# EAGLE design flexNT2_V1.0 (EAGLE 9.6.2)
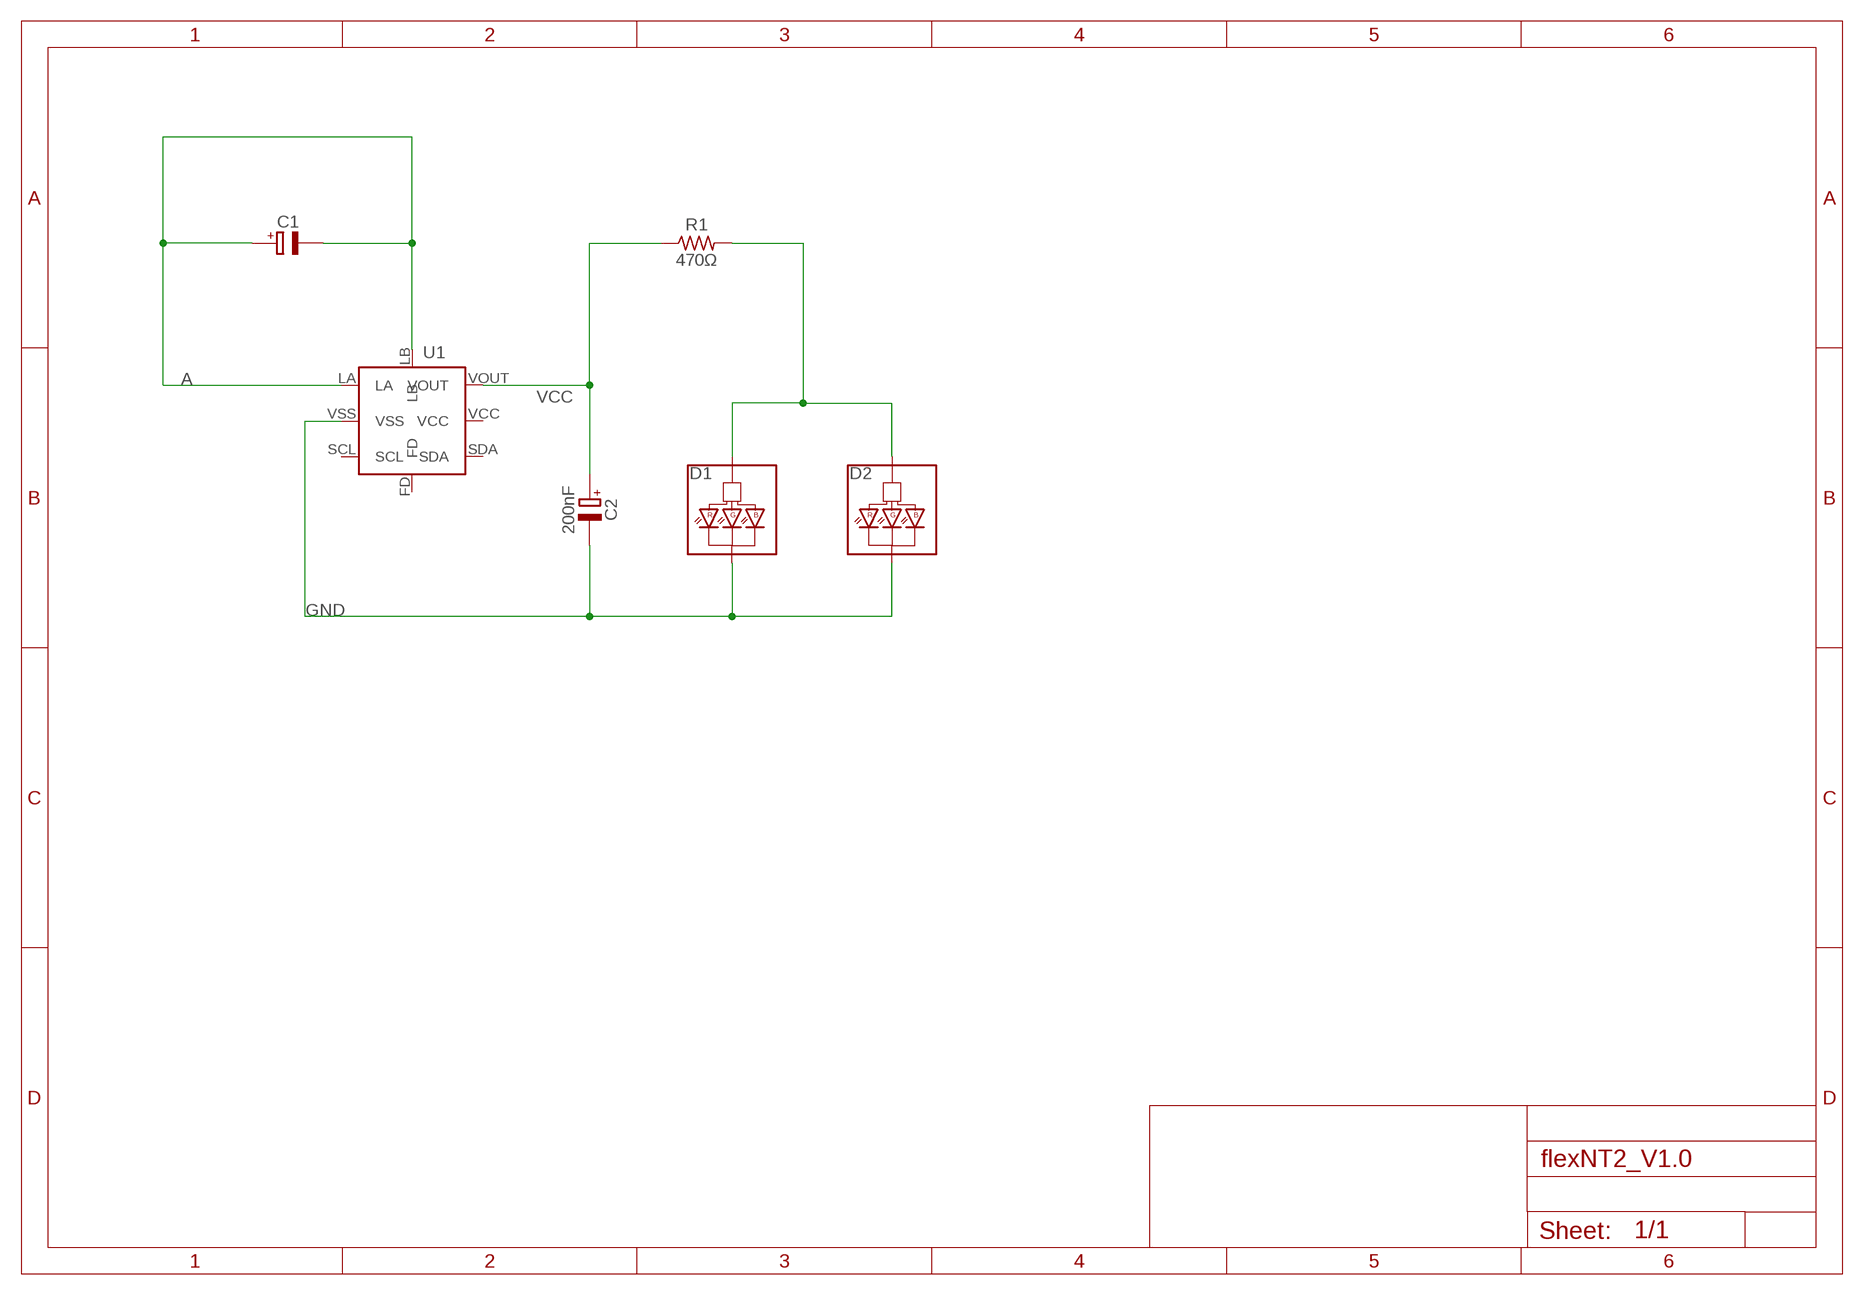
[diagram p0: schematic, sheet 1]

## Parts
C1  C_POL_0603_FLEX  [0603_FLEX_C_POL]
C2  200nF  C_POL_0603_FLEX  [0603_FLEX_C_POL]
D1  CZINELIGHT_0807RGBFF  [0807RGBFF_CZINELIGHT]
D2  CZINELIGHT_0807RGBFF  [0807RGBFF_CZINELIGHT]
R1  470Ω  R_0603_FLEX  [0603_FLEX]
U1  NTAG-I2C+  [XQFN8_NTAG-I2C+]

## Nets
A: C1.P$1(+) C1.P$2(-) U1.LA U1.LB
GND: C2.P$2(-) D1.P$2(C) D2.P$2(C) U1.VSS
N$3: D1.P$1(A) D2.P$1(A) R1.P$2
VCC: C2.P$1(+) R1.P$1 U1.VOUT
Unconnected: U1.FD U1.SCL U1.SDA U1.VCC

## Library data of the parts
C1 C2 = flexNT2_V1.0:C_POL
D1 D2 = flexNT2_V1.0:CZINELIGHT: https://czinelight.en.alibaba.com/product/62172100927-807984811/Czinelight_Quality_Smd_0805_Rgb_Tri_color_Led_Diode_Built_in_Ic_Fast_And_Slowly_Flashing_0807_Rgb_Blinking_Fading_Smd_Led_Chip.html
R1 = flexNT2_V1.0:R
U1 = flexNT2_V1.0:NTAG-I2C+: NT3H2211W0FHKH ~ NTAG I2C plus

## Board
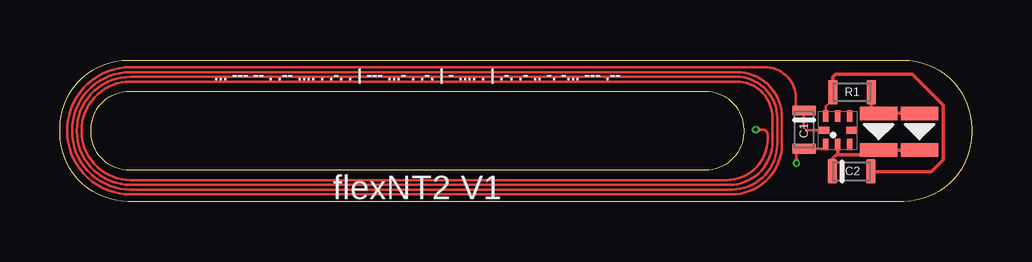
[diagram p1: board, top side]
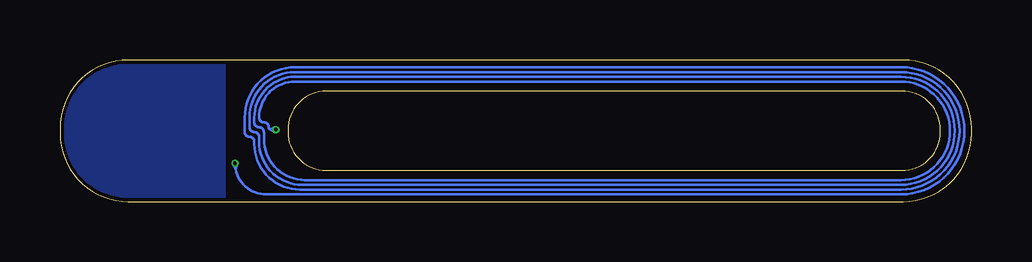
[diagram p2: board, bottom side, seen from below]

Size 38 x 5.9 mm. Coordinates in mm from the lower left corner, seen from the top.
Outline: 35.15,0 2.85,0 arc-90 0,2.85 0,3.05 arc-90 2.85,5.9 35.15,5.9 arc-90 38,3.05 38,2.85 arc-90 35.15,0
Outline: 26.9,1.3 2.9,1.3 arc-90 1.3,2.9 1.3,3 arc-90 2.9,4.6 26.9,4.6 arc-90 28.5,3 28.5,2.9 arc-90 26.9,1.3
Copper layers (1*16): Top 0.035mm / dielectric 0.13mm / Bottom 0.035mm
Design rules "PCBWay_Flex2Layer": minimum track width 0.06mm, minimum drill 0.15mm, track to track 0.06mm, track to pad 0.06mm, pad to pad 0.06mm, via to via 0.06mm, smd to smd 0.06mm, copper to edge 0.15mm, drill to drill 0.06mm, minimum pad ring 0.02mm, minimum via ring 0.075mm, stop-mask expansion 0.02mm, vias tented up to drill 0.5mm, thermal gap 10mil

### Footprints (pad centres in the part's own frame; a part is rotated, then mirrored left to right if it is on the bottom)
0603_FLEX_C_POL = smd 0.4 x 1: P$1 -0.8,0; P$2 0.8,0
0807RGBFF_CZINELIGHT = smd 0.57 x 1.57: P$1 -0.765,0; P$2 0.765,0
0603_FLEX = smd 0.4 x 1: P$1 -0.8,0; P$2 0.8,0
XQFN8_NTAG-I2C+ = smd 0.25 x 0.45: FD 0,-0.575; LB 0,0.575 | smd 0.45 x 0.25: LA -0.6,0.5; SCL -0.6,-0.5; SDA 0.6,-0.5; VCC 0.6,0; VOUT 0.6,0.5; VSS -0.6,0

### Placement (x,y rotation side)
C1  31.02,3 90 top
C2  33,1.26 180 top
D1  34.13,2.91 270 top
D2  35.83,2.91 270 top
R1  33.02,4.56 0 top
U1  32.42,2.97 90 top

### Tracks (layer width: path | path; a pad name or v marks a point on that pad's centre or on a via)
A  (via drill 0.15)
  Top 0.1: U1.LA 31.92,2.2 C1.P$1 30.7,2.2 30.7,1.82 | U1.LB 31.12,2.97 31.02,3.07 C1.P$2 30.68,3.8 30.68,4.3 arc90 29.38,5.6 2.95,5.6 arc90 0.3,2.95 arc90 2.95,0.3 28,0.3 arc90 30.1,2.4 30.1,3.5 arc90 28.2,5.4 2.95,5.4 arc90 0.5,2.95 arc90 2.95,0.5 28,0.5 arc90 29.9,2.4 29.9,3.5 arc90 28.2,5.2 2.95,5.2 arc90 0.7,2.95 arc90 2.95,0.7 27.9,0.7 arc90 29.7,2.5 29.7,3.5 arc90 28.2,5 2.95,5 arc90 0.9,2.95 arc90 2.95,0.9 27.8,0.9 arc90 29.5,2.6 29.5,2.8 arc90 29.3,3 29.23,3 | 29.23,3 v29,3 | v30.7,1.6 30.7,1.82 | 29.23,3 29.04,3.09 v29,3 | 29.23,3 29.04,2.91 v29,3 | 30.7,1.82 30.61,1.64 v30.7,1.6 | 30.7,1.82 30.79,1.64 v30.7,1.6
  Bottom 0.1: v30.7,1.6 arc-90 29.4,0.3 2.95,0.3 arc-90 0.3,2.95 arc-90 2.95,5.6 28.2,5.6 arc-90 30.3,3.5 30.3,2.9 arc-90 30.1,2.7 arc90 29.9,2.5 29.9,2.4 arc-90 28,0.5 2.95,0.5 arc-90 0.5,2.95 arc-90 2.95,5.4 28.2,5.4 arc-90 30.1,3.5 30.1,3.1 arc-90 29.9,2.9 arc90 29.7,2.7 29.7,2.5 arc-90 27.9,0.7 2.95,0.7 arc-90 0.7,2.95 arc-90 2.95,5.2 28.2,5.2 arc-90 29.9,3.5 29.9,3.3 arc-90 29.7,3.1 arc90 29.5,2.9 29.5,2.6 arc-90 27.8,0.9 2.95,0.9 arc-90 0.9,2.95 arc-90 2.95,5 28.2,5 arc-90 29.7,3.5 arc-90 29.5,3.3 arc90 29.3,3.1 arc-76 29.23,3 | v29,3 29.2,3 arc14 29.23,3 | 29.23,3 29.04,3.09 v29,3 | 29.23,3 29.05,2.91 v29,3 | v30.7,1.6 30.79,1.55 30.68,1.38 30.61,1.56 v30.7,1.6
GND
  Top 0.15: U1.VSS 32.42,2.01 32.37,1.96 | 32.37,1.96 32.2,1.79 C2.P$2 | D2.P$2 D1.P$2 33.95,1.96 32.37,1.96
N$3
  Top 0.1: 33.82,3.67 D1.P$1
  Top 0.15: D1.P$1 D2.P$1 | R1.P$2 33.82,3.67
SPACE
  pour Bottom (isolate 0.15): 31.1,6 35.1,6 arc-90 38.1,3 38.1,2.9 arc-90 35.1,-0.1 31.1,-0.1
VCC
  Top 0.1: 32.18,4.56 R1.P$1 32.12,4.46 32.12,4.17 31.92,3.97 U1.VOUT | C2.P$1
  Top 0.15: C2.P$1 36.33,1.25 36.83,1.75 36.83,4.01 35.53,5.31 32.32,5.31 32.22,5.21 R1.P$1

### Text on the board
tNames: ... --- -- . .-- .... . .-. . | --- ...- . .-. | - .... . | .-. .- .. -. -... --- .-- | flexNT2 V1